# Altium project CongToDienOnline.PrjPcb
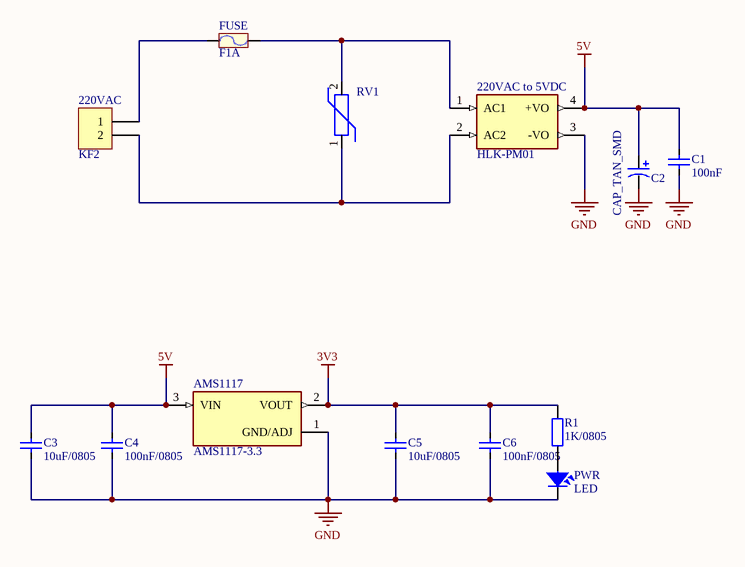
[diagram p0: Power.SchDoc]
4 sheets, 39 parts. Net scope: global (net labels, ports and power ports of the same name join across sheets).
Board file: CongToDienOnline.PcbDoc
Sheets:
  Power.SchDoc
  USB.SchDoc
  Output.SchDoc
  ESP32.SchDoc

## Sheet Power.SchDoc
size A; SheetNumber: 1; SheetTotal: 4

### Parts
220VAC  KF2  [KF2-7.62]
220VAC_to_5VDC  HLK-PM01  [CONV_HLK-PM01]
AMS1117  AMS1117-3.3  [SOT229P700X180-4N]
C1  100nF  [CAP_0402]
C2  CAP_TAN_SMD  [CAP_7343]
C3  10uF/0805  [CAP_0805]
C4  100nF/0805  [CAP_0805]
C5  10uF/0805  [CAP_0805]
C6  100nF/0805  [CAP_0805]
FUSE  F1A  [Fuse4]
PWR  LED  [LED-0805-Green]
R1  1K/0805  [RES-SMD-0805]
RV1  MOV-14D471K  [MOV14D471K]  (value not drawn)

### Nets
3V3: AMS1117.2(VOUT) C5.2 C6.2 R1.1
5V: 220VAC_to_5VDC.4(+VO) AMS1117.3(VIN) C1.2 C2.1 C3.2 C4.2
GND: 220VAC_to_5VDC.3(-VO) AMS1117.1(GND/ADJ) C1.1 C2.2 C3.1 C4.1 C5.1 C6.1 PWR.2
Net220VAC_1: 220VAC.1 FUSE.1
Net220VAC_2: 220VAC.2 220VAC_to_5VDC.2(AC2) RV1.1
Net220VAC_to_5VDC_1: 220VAC_to_5VDC.1(AC1) FUSE.2 RV1.2
NetPWR_1: PWR.1 R1.2

### Library data of the parts
220VAC = KF2: Manufacturer: Würth Elektronik eiSos GmbH; partNo: 691103110002; ComponentLink1 Description: Manufacturer; ComponentLink2 Description: Datasheet; NoPins: 2; Created Date: 29 October 2013; ComponentLink1URL: http://www.we-online.com; ComponentLink2URL: http://katalog.we-online.de/em/datasheet/6911031100xx.pdf; Created by: Karrer Zheng
220VAC_to_5VDC = HLK-PM01: The HLK-PM01 is a small size low cost AC to DC converter which can take in 110V/220V AC at 50/60 Hz and give 5V 3W output. The module is can be used in designs which run on 5V and needs to be powered form the AC mains.; MF: Hi-link; Package: None; Price: None; Value: *; SnapEDA_Link: https://www.snapeda.com/parts/hlk-pm01/Hi-link/view-part/?ref=snap; MP: hlk-pm01; Availability: Not in stock; Check_prices: https://www.snapeda.com/parts/hlk-pm01/Hi-link/view-part/?ref=eda
AMS1117 = AMS1117-3.3: Sot223/Pkg 1-Amp 3.3-Volt Low Drop Out Voltage Regulatator; MF: Advanced Monolithic Systems; Package: SOT-223 Seeed Technology; Value: *; Check_prices: https://www.snapeda.com/parts/AMS1117-3.3/Advanced+Monolithic+Systems/view-part/?ref=eda; Price: None; Availability: Not in stock; MP: AMS1117-3.3; SnapEDA_Link: https://www.snapeda.com/parts/AMS1117-3.3/Advanced+Monolithic+Systems/view-part/?ref=snap
C1 C3-C6 = CapSMD: Capacitor; Value: 33p; Published: 8-Jun-2000; LatestRevisionDate: 17-Jul-2002; LatestRevisionNote: Re-released for DXP Platform.; PackageReference: RAD-0.3; Publisher: Altium Limited
C2 = CAP_TAN_SMD: Polazied Tantalum Capacitor
FUSE = Fuse: Designed by: VanDungEvn; Value: Fuse
PWR = LED: LED Single colour Green and Red; Value: LED 3 ly Single Colour
R1 = Resistor - SMD: Resistor SMD; Manufacturer: Generic Components; Class: Passive; Published: 08/06/2000; Publisher: Altium Hobart Technology Centre
RV1 = MOV-14D471K: 470 V 4.5 kA Varistor 1 Circuit Through Hole Disc 14mm; MF: Bourns; SnapEDA_Link: https://www.snapeda.com/parts/MOV-14D471K/Bourns/view-part/?ref=snap; Check_prices: https://www.snapeda.com/parts/MOV-14D471K/Bourns/view-part/?ref=eda; Value: *; Purchase-URL: https://pricing.snapeda.com/search/part/MOV-14D471K/?ref=eda; Availability: In Stock; MP: MOV-14D471K; Price: None; Package: Disc-14 Bourns

## Sheet USB.SchDoc
size A; SheetNumber: 2; SheetTotal: 4
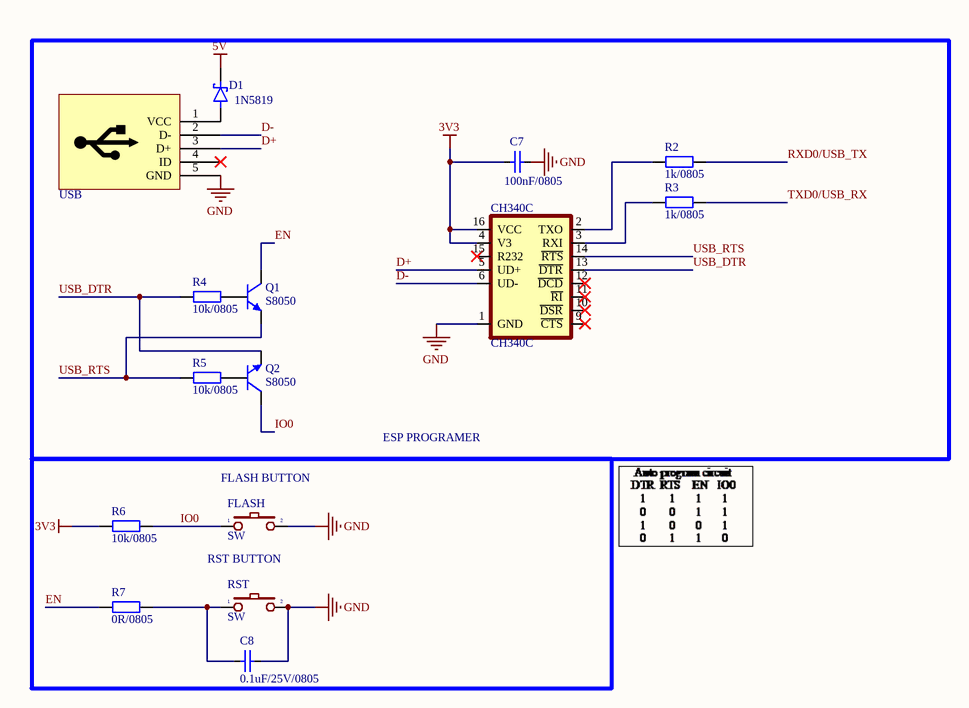
[diagram p1: USB.SchDoc]

### Parts
C7  100nF/0805  [CAP_0805]
C8  0.1uF/25V/0805  [CAP_0805]
CH340C  CH340C  [SOP-16]
D1  1N5819  [SOD3715X145N]
FLASH  SW  [SW-SMD]
Q1  S8050  [SOT23]
Q2  S8050  [SOT23]
R2  1k/0805  [RES-SMD-0805]
R3  1k/0805  [RES-SMD-0805]
R4  10k/0805  [RES-SMD-0805]
R5  10k/0805  [RES-SMD-0805]
R6  10k/0805  [RES-SMD-0805]
R7  0R/0805  [RES-SMD-0805]
RST  SW  [SW-SMD]
USB  USB  [HRS_ZX62D-B-5P8]  (value not drawn)

### Blocks framed on the sheet
ESP PROGRAMER: C7 CH340C D1 Q1 Q2 R2-R5 USB

### Nets
3V3: C7.1 CH340C.4(V3) CH340C.16(VCC) R6.2
5V: D1.C(K)
GND: C7.2 C8.2 CH340C.1(GND) FLASH.2 RST.2 USB.5(GND)
D+: CH340C.5(UD+) USB.3(D+)
D-: CH340C.6(UD-) USB.2(D-)
EN: Q1.2(C) R7.2
IO0: FLASH.1 Q2.2(C) R6.1
RXD0/USB_TX: R2.2
TXD0/USB_RX: R3.2
USB_DTR: CH340C.13(~{DTR}) Q2.1(E) R4.2
USB_RTS: CH340C.14(~{RTS}) Q1.1(E) R5.2
NetC8_1: C8.1 R7.1 RST.1
NetCH340C_2: CH340C.2(TXO) R2.1
NetCH340C_3: CH340C.3(RXI) R3.1
NetD1_A: D1.A USB.1(VCC)
NetQ1_3: Q1.3(B) R4.1
NetQ2_3: Q2.3(B) R5.1

Not connected (* = marked no-connect by the designer): CH340C 9(~{CTS})* 10(~{DSR})* 11(~{RI})* 12(~{DCD})* 15(R232)*; USB 4(ID)*

### Notes on the sheet
- (near FLASH) FLASH BUTTON
- RST BUTTON

### Library data of the parts
C7 C8 = CapSMD: Capacitor; Value: 33p; Published: 8-Jun-2000; LatestRevisionDate: 17-Jul-2002; LatestRevisionNote: Re-released for DXP Platform.; PackageReference: RAD-0.3; Publisher: Altium Limited
CH340C = CH340C: USB to serial chip CH340; MF: WCH; Package: Package; Check_prices: https://www.snapeda.com/parts/CH340C/WCH/view-part/5428851/?ref=eda; Value: *; Price: None; MP: CH340C; Availability: Unavailable; SnapEDA_Link: https://www.snapeda.com/parts/CH340C/WCH/view-part/5428851/?ref=snap
D1 = 1N5819HW-7-F: Diode Schottky 40 V 1A Surface Mount SOD-123; MF: Diodes Inc.; Value: *; SnapEDA_Link: https://www.snapeda.com/parts/1N5819HW-7-F/Diodes+Inc./view-part/?ref=snap; Purchase-URL: https://pricing.snapeda.com/search/part/1N5819HW-7-F/?ref=eda; Availability: In Stock; Price: None; Package: SOD-123 Fairchild Semiconductor; Check_prices: https://www.snapeda.com/parts/1N5819HW-7-F/Diodes+Inc./view-part/?ref=eda; MP: 1N5819HW-7-F
FLASH RST = SW2: Switch button 2 pin; Value: SW chip 2 pin
Q1 Q2 = NPN: NPN General; Published: 8-Jun-2000; LatestRevisionDate: 15-Jan-2003; LatestRevisionNote: PCB Footprint 'BCY-W3/D4.7' replaced; DatasheetDocument: 1997; PackageDocument: Sep-1998; PackageReference: TO-92A; Publisher: Altium Limited; Code_JEDEC: TO-92A; ComponentLink1Description: Manufacturer Link; ComponentLink1URL: http://www.fairchildsemi.com/; ComponentLink2Description: Datasheet; ComponentLink2URL: http://www.fairchildsemi.com/ds/2N%2F2N3904.pdf
R2-R7 = Resistor - SMD: as R1 on sheet Power; Published: 08/06/2000; Publisher: Altium Hobart Technology Centre
USB = USB-M

## Sheet Output.SchDoc
size A; SheetNumber: 3; SheetTotal: 4
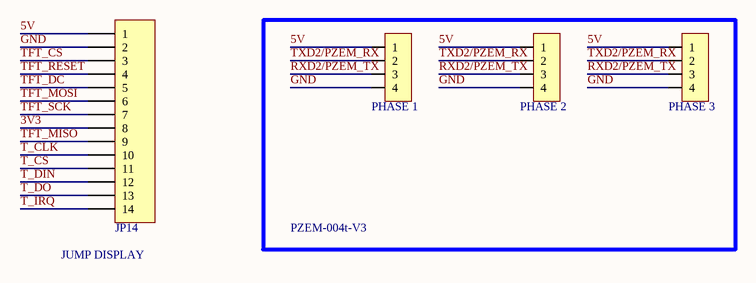
[diagram p2: Output.SchDoc]

### Parts
DISPLAY  JP14  [JP14-D1T]
PHASE_1  PHASE 1  [JP4-C1T]
PHASE_2  PHASE 2  [JP4-C1T]
PHASE_3  PHASE 3  [JP4-C1T]

### Blocks framed on the sheet
PZEM-004t-V3: PHASE_1-PHASE_3

### Nets
3V3: DISPLAY.8
5V: DISPLAY.1 PHASE_1.1 PHASE_2.1 PHASE_3.1
GND: DISPLAY.2 PHASE_1.4 PHASE_2.4 PHASE_3.4
RXD2/PZEM_TX: PHASE_1.3 PHASE_2.3 PHASE_3.3
T_CLK: DISPLAY.7 DISPLAY.10  [also labelled TFT_SCK]
T_CS: DISPLAY.11
T_DIN: DISPLAY.6 DISPLAY.12  [also labelled TFT_MOSI]
T_DO: DISPLAY.9 DISPLAY.13  [also labelled TFT_MISO]
T_IRQ: DISPLAY.14
TFT_CS: DISPLAY.3
TFT_DC: DISPLAY.5
TFT_RESET: DISPLAY.4
TXD2/PZEM_RX: PHASE_1.2 PHASE_2.2 PHASE_3.2

### Notes on the sheet
- (near DISPLAY) JUMP DISPLAY

### Library data of the parts
DISPLAY = JP14: WR-PHD 2.54 mm Angled Socket Header; Manufacturer: W¨¹rth Elektronik eiSos GmbH; partNo: 613014143121; ComponentLink1 Description: Manufacturer; ComponentLink2 Description: Datasheet; NoPins: 14; Created Date: 29 March 2013; ComponentLink1URL: http://www.we-online.com; ComponentLink2URL: http://katalog.we-online.de/em/datasheet/6130xx143121.pdf; Created by: Karrer Zheng
PHASE_1-PHASE_3 = JP4: WR-PHD 2.54 mm Angled Socket Header; Manufacturer: W¨¹rth Elektronik eiSos GmbH; partNo: 613004143121; ComponentLink1 Description: Manufacturer; ComponentLink2 Description: Datasheet; NoPins: 04; Created Date: 29 March 2013; ComponentLink1URL: http://www.we-online.com; ComponentLink2URL: http://katalog.we-online.de/em/datasheet/6130xx143121.pdf; Created by: Karrer Zheng

## Sheet ESP32.SchDoc
size A; SheetNumber: 4; SheetTotal: 4
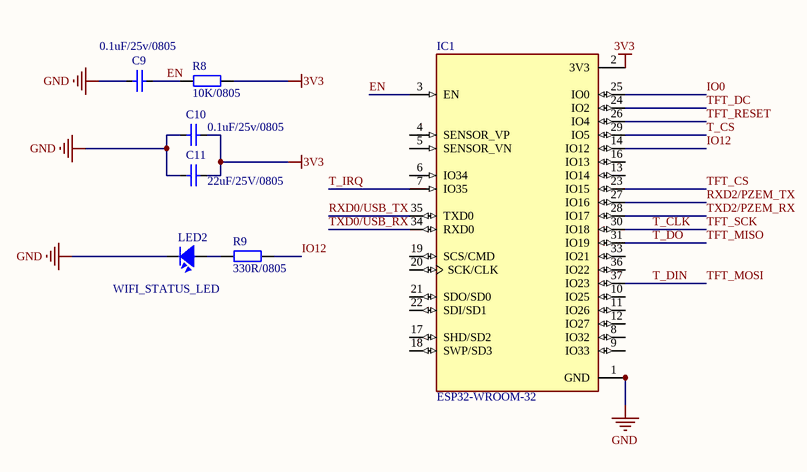
[diagram p3: ESP32.SchDoc]

### Parts
C9  0.1uF/25v/0805  [CAP_0805]
C10  0.1uF/25v/0805  [CAP_0805]
C11  22uF/25V/0805  [CAP_0805]
IC1  ESP32-WROOM-32  [MODULE_ESP32-WROOM-32]
LED2  WIFI_STATUS_LED  [LED-3]
R8  10K/0805  [RES-SMD-0805]
R9  330R/0805  [RES-SMD-0101]

### Nets
3V3: C10.2 C11.2 IC1.2(3V3) R8.2
GND: C9.1 C10.1 C11.1 IC1.1(GND) IC1.15(GND) IC1.38(GND) IC1.39_1(GND) IC1.39_2(GND) IC1.39_3(GND) IC1.39_4(GND) IC1.39_5(GND) IC1.39_6(GND) IC1.39_7(GND) IC1.39_8(GND) IC1.39_9(GND) IC1.39_10(GND) IC1.39_11(GND) IC1.39_12(GND) IC1.39_13(GND) IC1.39_14(GND) IC1.39_15(GND) IC1.39_16(GND) IC1.39_17(GND) IC1.39_18(GND) IC1.39_19(GND) IC1.39_20(GND) IC1.39_21(GND) LED2.2
EN: C9.2 IC1.3(EN) R8.1
IO0: IC1.25(IO0)
IO12: IC1.14(IO12) R9.1
RXD0/USB_TX: IC1.35(TXD0)
RXD2/PZEM_TX: IC1.27(IO16)
T_CLK: IC1.30(IO18)  [also labelled TFT_SCK]
T_CS: IC1.29(IO5)
T_DIN: IC1.37(IO23)  [also labelled TFT_MOSI]
T_DO: IC1.31(IO19)  [also labelled TFT_MISO]
T_IRQ: IC1.7(IO35)
TFT_CS: IC1.23(IO15)
TFT_DC: IC1.24(IO2)
TFT_RESET: IC1.26(IO4)
TXD0/USB_RX: IC1.34(RXD0)
TXD2/PZEM_RX: IC1.28(IO17)
NetLED2_1: LED2.1 R9.2

Not connected (* = marked no-connect by the designer): IC1 4(SENSOR_VP) 5(SENSOR_VN) 6(IO34) 8(IO32) 9(IO33) 10(IO25) 11(IO26) 12(IO27) 13(IO14) 16(IO13) 17(SHD/SD2) 18(SWP/SD3) 19(SCS/CMD) 20(SCK/CLK) 21(SDO/SD0) 22(SDI/SD1) 33(IO21) 36(IO22)

### Library data of the parts
C9-C11 = CapSMD: Capacitor; Value: 33p; Published: 8-Jun-2000; LatestRevisionDate: 17-Jul-2002; LatestRevisionNote: Re-released for DXP Platform.; PackageReference: RAD-0.3; Publisher: Altium Limited
IC1 = ESP32-WROOM-32: Bluetooth, WiFi Transceiver Module 2.4GHz ~ 2.5GHz Surface Mount; MF: Espressif Systems; Package: Module Espressif Systems; Digi-Key_Part_Number: 1904-1010-1-ND; Digi-Key_Purchase_URL: https://www.digikey.com/product-detail/en/espressif-systems/ESP32-WROOM-32/1904-1010-1-ND/8544305?utm_source=snapeda&utm_medium=aggregator&utm_campaign=symbol; Value: *; MP: ESP32-WROOM-32; SnapEDA_Link: https://www.snapeda.com/parts/ESP32-WROOM-32/Espressif%20Systems/view-part/2753322/?ref=snap
LED2 = LED: as PWR on sheet Power
R8 R9 = Resistor - SMD: as R1 on sheet Power; Published: 08/06/2000; Publisher: Altium Hobart Technology Centre

## Nets that join several sheets
3V3: Power (AMS1117.2 C5.2 C6.2 R1.1), USB (C7.1 CH340C.4 CH340C.16 R6.2), Output (DISPLAY.8), ESP32 (C10.2 C11.2 IC1.2 R8.2)
5V: Power (6 pins), USB (D1.C), Output (DISPLAY.1 PHASE_1.1 PHASE_2.1 PHASE_3.1)
GND: Power (9 pins), USB (6 pins), Output (DISPLAY.2 PHASE_1.4 PHASE_2.4 PHASE_3.4), ESP32 (28 pins)
EN: USB (Q1.2 R7.2), ESP32 (C9.2 IC1.3 R8.1)
IO0: USB (FLASH.1 Q2.2 R6.1), ESP32 (IC1.25)
RXD0/USB_TX: USB (R2.2), ESP32 (IC1.35)
RXD2/PZEM_TX: Output (PHASE_1.3 PHASE_2.3 PHASE_3.3), ESP32 (IC1.27)
T_CLK: Output (DISPLAY.7 DISPLAY.10), ESP32 (IC1.30)
T_CS: Output (DISPLAY.11), ESP32 (IC1.29)
T_DIN: Output (DISPLAY.6 DISPLAY.12), ESP32 (IC1.37)
T_DO: Output (DISPLAY.9 DISPLAY.13), ESP32 (IC1.31)
T_IRQ: Output (DISPLAY.14), ESP32 (IC1.7)
TFT_CS: Output (DISPLAY.3), ESP32 (IC1.23)
TFT_DC: Output (DISPLAY.5), ESP32 (IC1.24)
TFT_RESET: Output (DISPLAY.4), ESP32 (IC1.26)
TXD0/USB_RX: USB (R3.2), ESP32 (IC1.34)
TXD2/PZEM_RX: Output (PHASE_1.2 PHASE_2.2 PHASE_3.2), ESP32 (IC1.28)